# EAGLE schematic Board no 0R (EAGLE 9.6.2)
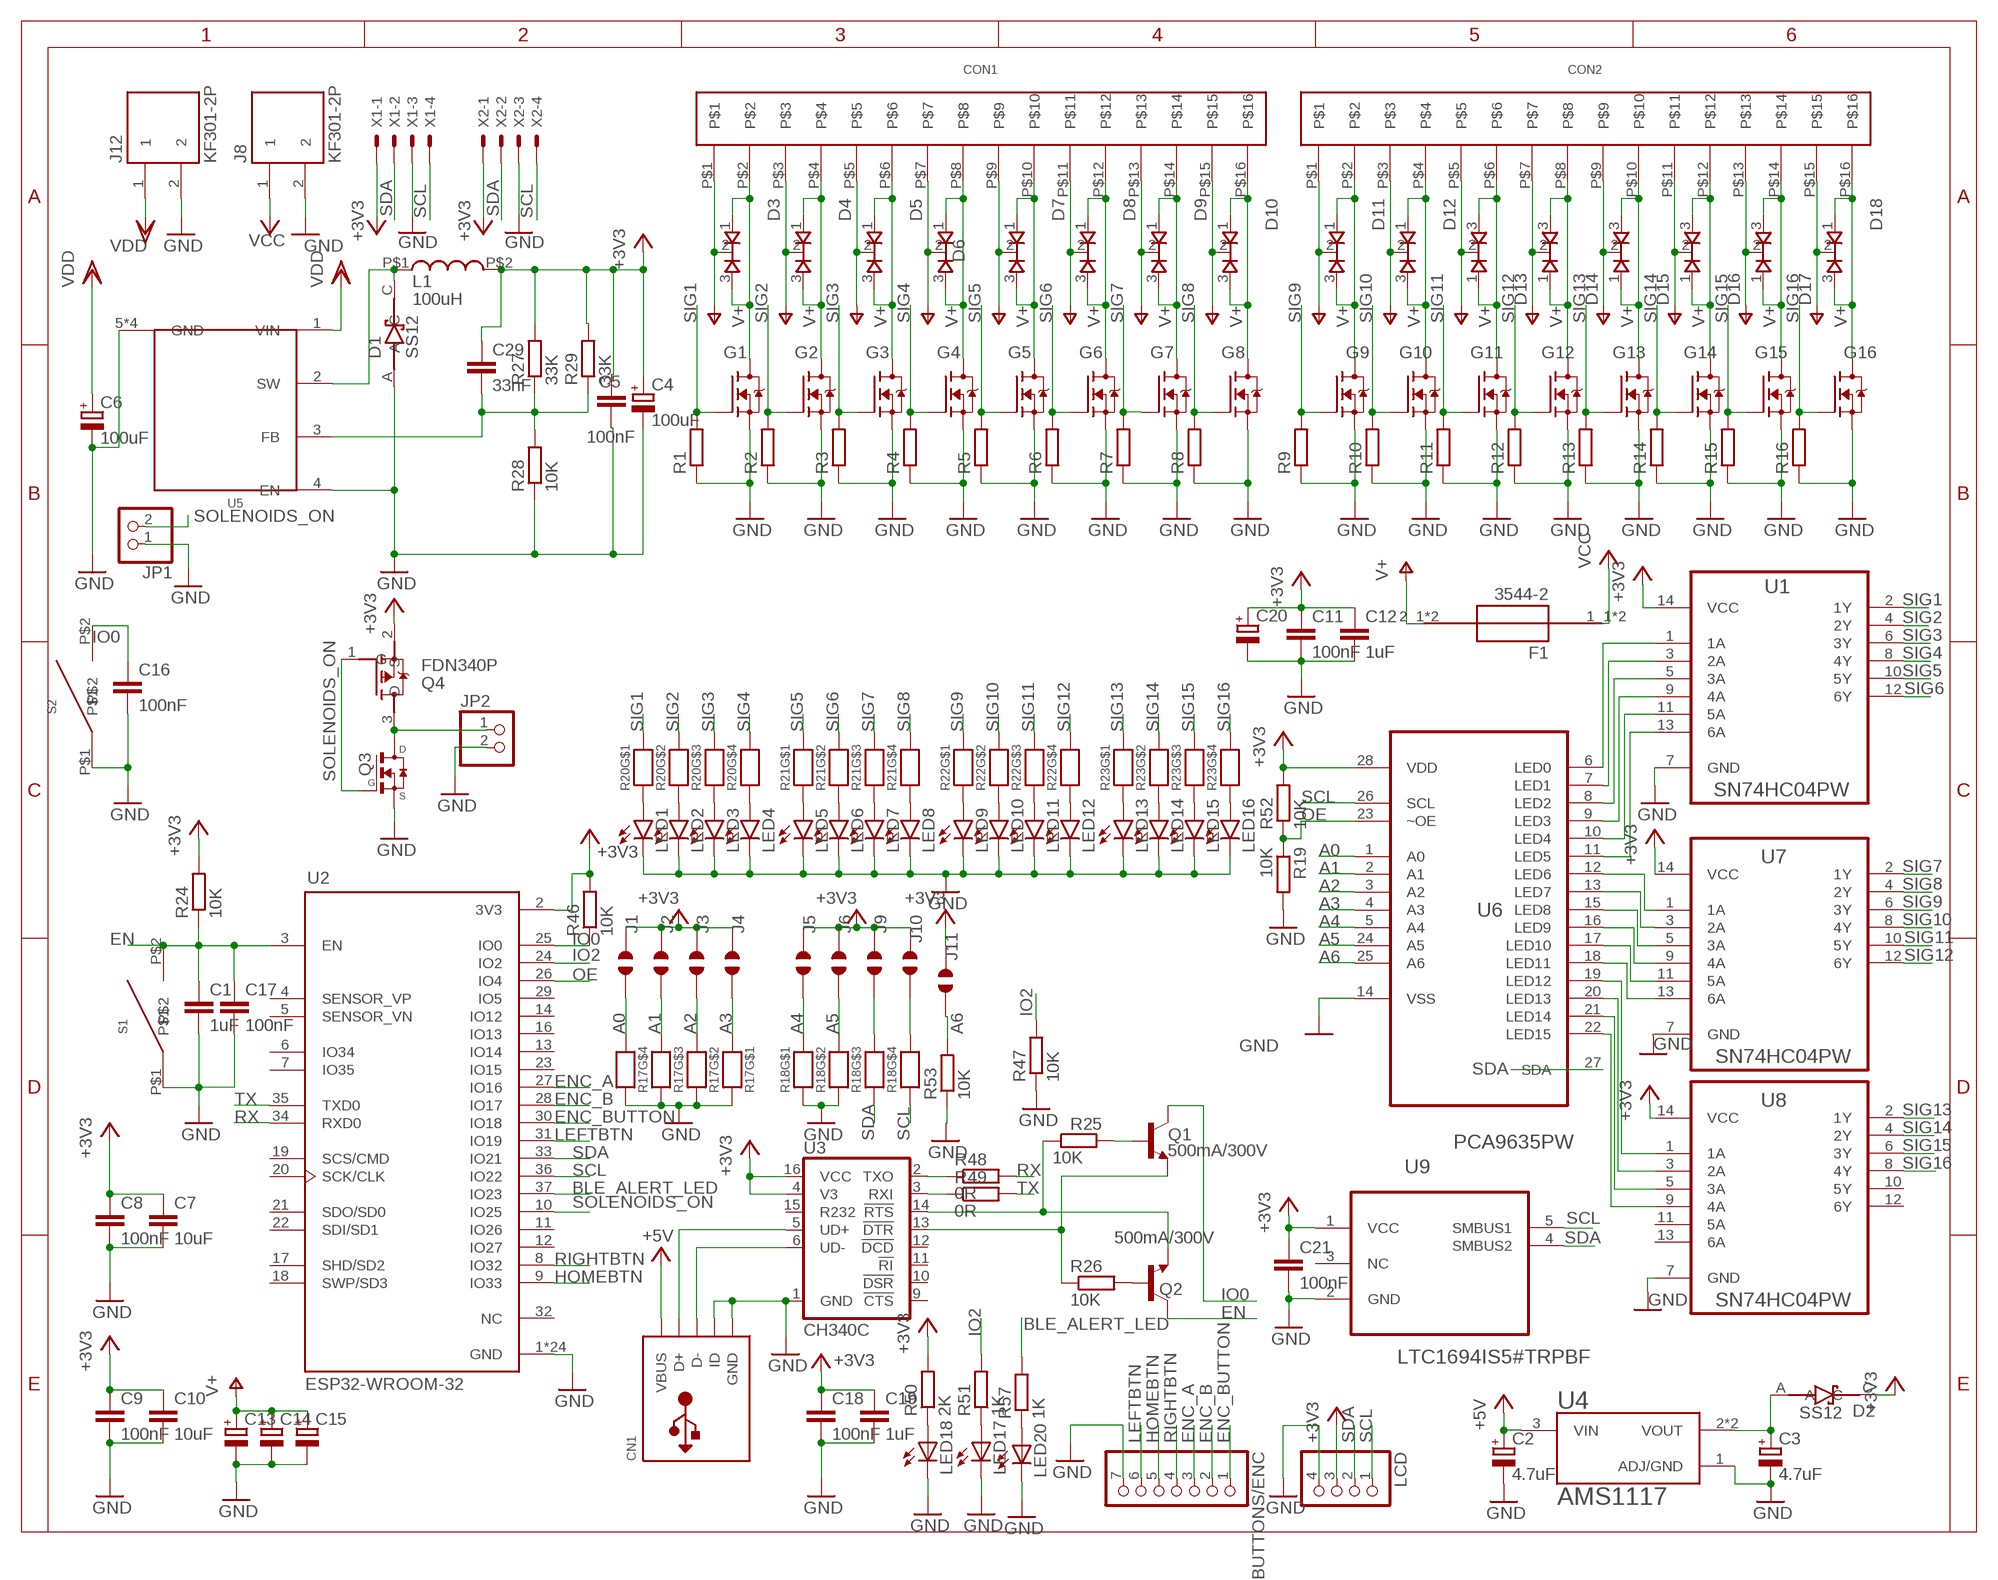
[diagram p0: schematic, sheet 1]

## Parts
BUTTONS/ENC  PINHD-1X7  [1X07]
C1  1uF  C-EUC0603  [C0603]
C2  4.7uF  CPOL-EUC/6032-28R  [C/6032-28R]
C3  4.7uF  CPOL-EUC/6032-28R  [C/6032-28R]
C4  100uF  CPOL-EUC/6032-28R  [C/6032-28R]
C5  100nF  C-EUC0603  [C0603]
C6  100uF  CPOL-EUC/6032-28R  [C/6032-28R]
C7  10uF  C-EUC0603  [C0603]
C8  100nF  C-EUC0603  [C0603]
C9  100nF  C-EUC0603  [C0603]
C10  10uF  C-EUC0603  [C0603]
C11  100nF  C-EUC0603  [C0603]
C12  1uF  C-EUC0603  [C0603]
C13  CPOL-EUE5-10.5  [E5-10,5]
C14  CPOL-EUE5-10.5  [E5-10,5]
C15  CPOL-EUE5-10.5  [E5-10,5]
C16  100nF  C-EUC0603  [C0603]
C17  100nF  C-EUC0603  [C0603]
C18  100nF  C-EUC0603  [C0603]
C19  1uF  C-EUC0603  [C0603]
C20  CPOL-EUB  [PANASONIC_B]
C21  100nF  C-EUC0603  [C0603]
C29  33nF  C-EUC0603  [C0603]
CN1  USBMINIB  [USB-MINIB]
CON1  2.54-16P  [2.54-16P]
CON2  2.54-16P  [2.54-16P]
D1  SS12  [DIOM4427X270N]
D2  SS12  [DIOM4427X270N]
D3  BYQ28E  [TO220V]
D4  BYQ28E  [TO220V]
D5  BYQ28E  [TO220V]
D6  BYQ28E  [TO220V]
D7  BYQ28E  [TO220V]
D8  BYQ28E  [TO220V]
D9  BYQ28E  [TO220V]
D10  BYQ28E  [TO220V]
D11  BYQ28E  [TO220V]
D12  BYQ28E  [TO220V]
D13  BYQ28E  [TO220V]
D14  BYQ28E  [TO220V]
D15  BYQ28E  [TO220V]
D16  BYQ28E  [TO220V]
D17  BYQ28E  [TO220V]
D18  BYQ28E  [TO220V]
F1  3544-2  [FUSE_3544-2]
G1  IRL540N  [TO220V]
G2  IRL540N  [TO220V]
G3  IRL540N  [TO220V]
G4  IRL540N  [TO220V]
G5  IRL540N  [TO220V]
G6  IRL540N  [TO220V]
G7  IRL540N  [TO220V]
G8  IRL540N  [TO220V]
G9  IRL540N  [TO220V]
G10  IRL540N  [TO220V]
G11  IRL540N  [TO220V]
G12  IRL540N  [TO220V]
G13  IRL540N  [TO220V]
G14  IRL540N  [TO220V]
G15  IRL540N  [TO220V]
G16  IRL540N  [TO220V]
J1  JUMPER_SOLDER_1X2  [JUMPER_SOLDER_1X2]
J2  JUMPER_SOLDER_1X2  [JUMPER_SOLDER_1X2]
J3  JUMPER_SOLDER_1X2  [JUMPER_SOLDER_1X2]
J4  JUMPER_SOLDER_1X2  [JUMPER_SOLDER_1X2]
J5  JUMPER_SOLDER_1X2  [JUMPER_SOLDER_1X2]
J6  JUMPER_SOLDER_1X2  [JUMPER_SOLDER_1X2]
J8  KF301-2P  [KF301-2P]
J9  JUMPER_SOLDER_1X2  [JUMPER_SOLDER_1X2]
J10  JUMPER_SOLDER_1X2  [JUMPER_SOLDER_1X2]
J11  JUMPER_SOLDER_1X2  [JUMPER_SOLDER_1X2]
J12  KF301-2P  [KF301-2P]
JP1  PINHD-1X2  [1X02]
JP2  PINHD-1X2  [1X02]
L1  100uH  CD43  [CD43]
LCD  PINHD-1X4  [1X04]
LED1  LEDSMT1206  [1206]
LED2  LEDSMT1206  [1206]
LED3  LEDSMT1206  [1206]
LED4  LEDSMT1206  [1206]
LED5  LEDSMT1206  [1206]
LED6  LEDSMT1206  [1206]
LED7  LEDSMT1206  [1206]
LED8  LEDSMT1206  [1206]
LED9  LEDSMT1206  [1206]
LED10  LEDSMT1206  [1206]
LED11  LEDSMT1206  [1206]
LED12  LEDSMT1206  [1206]
LED13  LEDSMT1206  [1206]
LED14  LEDSMT1206  [1206]
LED15  LEDSMT1206  [1206]
LED16  LEDSMT1206  [1206]
LED17  LED-0603  [LED-603]
LED18  LED-0603  [LED-603]
LED20  LED-0603  [LED-603]
Q1  500mA/300V  TRANS_NPN-MMBTA42  [SOT23-3]
Q2  500mA/300V  TRANS_NPN-MMBTA42  [SOT23-3]
Q3  FDN337N  [SSOT-3]
Q4  FDN340P  [SOT95P240X120-3N]
R1  R-EU_R0603  [R0603]
R2  R-EU_R0603  [R0603]
R3  R-EU_R0603  [R0603]
R4  R-EU_R0603  [R0603]
R5  R-EU_R0603  [R0603]
R6  R-EU_R0603  [R0603]
R7  R-EU_R0603  [R0603]
R8  R-EU_R0603  [R0603]
R9  R-EU_R0603  [R0603]
R10  R-EU_R0603  [R0603]
R11  R-EU_R0603  [R0603]
R12  R-EU_R0603  [R0603]
R13  R-EU_R0603  [R0603]
R14  R-EU_R0603  [R0603]
R15  R-EU_R0603  [R0603]
R16  R-EU_R0603  [R0603]
R17  MICROBUILDER_RESISTOR_4PACK  [MICROBUILDER_RESPACK_4X0603]
R18  MICROBUILDER_RESISTOR_4PACK  [MICROBUILDER_RESPACK_4X0603]
R19  10K  R-EU_R1206  [R1206]
R20  MICROBUILDER_RESISTOR_4PACK  [MICROBUILDER_RESPACK_4X0603]
R21  MICROBUILDER_RESISTOR_4PACK  [MICROBUILDER_RESPACK_4X0603]
R22  MICROBUILDER_RESISTOR_4PACK  [MICROBUILDER_RESPACK_4X0603]
R23  MICROBUILDER_RESISTOR_4PACK  [MICROBUILDER_RESPACK_4X0603]
R24  10K  R-EU_R0603  [R0603]
R25  10K  R-EU_R0603  [R0603]
R26  10K  R-EU_R0603  [R0603]
R27  33K  R-EU_R0603  [R0603]
R28  10K  R-EU_R0603  [R0603]
R29  33K  R-EU_R0603  [R0603]
R46  10K  R-EU_R0603  [R0603]
R47  10K  R-EU_R0603  [R0603]
R48  0R  R-EU_R0603  [R0603]
R49  0R  R-EU_R0603  [R0603]
R50  2K  R-EU_R0603  [R0603]
R51  1K  R-EU_R0603  [R0603]
R52  10K  R-EU_R0603  [R0603]
R53  10K  R-EU_R0603  [R0603]
R57  1K  R-EU_R0603  [R0603]
S1  3X6X2.5  [3X6X2.5]
S2  3X6X2.5  [3X6X2.5]
U1  SN74HC04PW  [SOP65P640X120-14N]
U2  ESP32-WROOM-32  [MODULE_ESP32-WROOM-32]
U3  CH340C  [SO016]
U4  AMS1117  [SOT229P700X180-4N]
U5  XL7005A  [SO8]
U6  PCA9635PW  [SOP65P640X110-28N]
U7  SN74HC04PW  [SOP65P640X120-14N]
U8  SN74HC04PW  [SOP65P640X120-14N]
U9  LTC1694IS5#TRPBF  [SOT95P280X100-5N]
X1  JST-XH-04-PIN-LONG-PAD  [JST-XH-04-PACKAGE-LONG-PAD]
X2  JST-XH-04-PIN-LONG-PAD  [JST-XH-04-PACKAGE-LONG-PAD]

## Nets
+3V3: C4.+ C5.1 C7.1 C8.1 C9.1 C10.1 C11.1 C12.1 C18.1 C19.1 C20.+ C21.1 C29.1 D2.C J1.1 J2.1 J3.1 J4.1 J5.1 J6.1 J9.1 J10.1 J11.1 L1.P$2 LCD.3 Q4.2(S) R24.2 R27.2 R29.2 R46.2 R50.2 R52.2 U1.14(VCC) U2.2(3V3) U3.4(V3) U3.16(VCC) U6.28(VDD) U7.14(VCC) U8.14(VCC) U9.1(VCC) X1.1 X2.1
+5V: C2.+ CN1.VBUS U4.3(VIN)
A0: J1.2 R17.4 U6.1(A0)
A1: J2.2 R17.3 U6.2(A1)
A2: J3.2 R17.2 U6.3(A2)
A3: J4.2 R17.1 U6.4(A3)
A4: J5.2 R18.8 U6.5(A4)
A5: J6.2 R18.7 U6.24(A5)
A6: J11.2 R53.2 U6.25(A6)
BLE_ALERT_LED: R57.2 U2.37(IO23)
EN: C1.1 C17.1 Q2.3(C) R24.1 S1.P$2 U2.3(EN)
ENC_A: BUTTONS/ENC.3 U2.27(IO16)
ENC_B: BUTTONS/ENC.2 U2.28(IO17)
ENC_BUTTON: BUTTONS/ENC.1 U2.30(IO18)
GND: BUTTONS/ENC.7 C1.2 C2.- C3.- C4.- C5.2 C6.- C7.2 C8.2 C9.2 C10.2 C11.2 C12.2 C13.- C14.- C15.- C16.2 C17.2 C18.2 C19.2 C20.- C21.2 CN1.GND CN1.ID D1.A G1.3(S) G2.3(S) G3.3(S) G4.3(S) G5.3(S) G6.3(S) G7.3(S) G8.3(S) G9.3(S) G10.3(S) G11.3(S) G12.3(S) G13.3(S) G14.3(S) G15.3(S) G16.3(S) J8.2 J12.2 JP1.1 JP2.2 LCD.4 LED1.C LED2.C LED3.C LED4.C LED5.C LED6.C LED7.C LED8.C LED9.C LED10.C LED11.C LED12.C LED13.C LED14.C LED15.C LED16.C LED17.C LED18.C LED20.C Q3.2(S) R1.1 R2.1 R3.1 R4.1 R5.1 R6.1 R7.1 R8.1 R9.1 R10.1 R11.1 R12.1 R13.1 R14.1 R15.1 R16.1 R17.5 R17.6 R17.7 R17.8 R18.1 R18.2 R19.2 R28.1 R47.1 R53.1 S1.P$1 S2.P$1 U1.7(GND) U2.1(GND) U2.15(GND) U2.38(GND) U2.39_1(GND) U2.39_2(GND) U2.39_3(GND) U2.39_4(GND) U2.39_5(GND) U2.39_6(GND) U2.39_7(GND) U2.39_8(GND) U2.39_9(GND) U2.39_10(GND) U2.39_11(GND) U2.39_12(GND) U2.39_13(GND) U2.39_14(GND) U2.39_15(GND) U2.39_16(GND) U2.39_17(GND) U2.39_18(GND) U2.39_19(GND) U2.39_20(GND) U2.39_21(GND) U3.1(GND) U4.1(ADJ/GND) U5.4(EN) U5.5(GND) U5.6(GND) U5.7(GND) U5.8(GND) U6.14(VSS) U7.7(GND) U8.7(GND) U9.2(GND) X1.3 X2.3
HOMEBTN: BUTTONS/ENC.5 U2.9(IO33)
IO0: C16.1 Q1.3(C) R46.1 S2.P$2 U2.25(IO0)
IO2: R47.2 R51.2 U2.24(IO2)
LEFTBTN: BUTTONS/ENC.6 U2.31(IO19)
N$1 [power]: CON1.P$2 D3.1 D3.3 G1.2(D)
N$2 [power]: CON1.P$4 D4.1 D4.3 G2.2(D)
N$3 [power]: CON1.P$6 D5.1 D5.3 G3.2(D)
N$4 [power]: CON1.P$8 D6.1 D6.3 G4.2(D)
N$5 [power]: CON1.P$10 D7.1 D7.3 G5.2(D)
N$6 [power]: CON1.P$12 D8.1 D8.3 G6.2(D)
N$7 [power]: CON1.P$14 D9.1 D9.3 G7.2(D)
N$8 [power]: CON1.P$16 D10.1 D10.3 G8.2(D)
N$9 [power]: CON2.P$2 D11.1 D11.3 G9.2(D)
N$10 [power]: CON2.P$4 D12.1 D12.3 G10.2(D)
N$11 [power]: CON2.P$6 D13.1 D13.3 G11.2(D)
N$12 [power]: CON2.P$8 D14.1 D14.3 G12.2(D)
N$13 [power]: CON2.P$10 D15.1 D15.3 G13.2(D)
N$14 [power]: CON2.P$12 D16.1 D16.3 G14.2(D)
N$15 [power]: CON2.P$14 D17.1 D17.3 G15.2(D)
N$16 [power]: CON2.P$16 D18.1 D18.3 G16.2(D)
N$17: Q1.1(B) R25.2
N$18: Q2.1(B) R26.2
N$19: LED1.A R20.1
N$20: LED2.A R20.2
N$21: LED3.A R20.3
N$22: LED4.A R20.4
N$23: LED5.A R21.1
N$24: LED6.A R21.2
N$25: LED7.A R21.3
N$27: LED8.A R21.4
N$28: LED9.A R22.1
N$29: LED10.A R22.2
N$30: LED11.A R22.3
N$31: LED12.A R22.4
N$32: LED13.A R23.1
N$33: LED14.A R23.2
N$34: LED15.A R23.3
N$35: Q2.2(E) R25.1 U3.14(!RTS)
N$36: Q1.2(E) R26.1 U3.13(!DTR)
N$37: JP2.1 Q3.3(D) Q4.3(D)
N$38: J9.2 R18.6
N$39: CN1.D- U3.6(UD-)
N$40: CN1.D+ U3.5(UD+)
N$41: J10.2 R18.5
N$42: C3.+ D2.A U4.2(VOUT) U4.4(VOUT)
N$43: LED16.A R23.4
N$44: C29.2 R27.1 R28.2 R29.1 U5.3(FB)
N$46: R48.1 U3.2(TXO)
N$48: R49.1 U3.3(RXI)
N$50: LED20.A R57.1
N$54: LED18.A R50.1
N$64: LED17.A R51.1
N$65: D1.C L1.P$1 U5.2(SW)
N$66: U1.1(1A) U6.6(LED0)
N$67: U1.3(2A) U6.7(LED1)
N$68: U1.5(3A) U6.8(LED2)
N$69: U1.9(4A) U6.9(LED3)
N$70: U1.11(5A) U6.10(LED4)
N$71: U1.13(6A) U6.11(LED5)
N$72: U6.12(LED6) U7.1(1A)
N$73: U6.13(LED7) U7.3(2A)
N$74: U6.15(LED8) U7.5(3A)
N$75: U6.16(LED9) U7.9(4A)
N$76: U6.17(LED10) U7.11(5A)
N$77: U6.18(LED11) U7.13(6A)
N$78: U6.19(LED12) U8.1(1A)
N$79: U6.20(LED13) U8.3(2A)
N$80: U6.21(LED14) U8.5(3A)
N$81: U6.22(LED15) U8.9(4A)
OE: R19.1 R52.1 U2.26(IO4) U6.23(~OE)
RIGHTBTN: BUTTONS/ENC.4 U2.8(IO32)
RX: R48.2 U2.34(RXD0)
SCL: LCD.1 R18.4 U2.36(IO22) U6.26(SCL) U9.5(SMBUS1) X1.4 X2.4
SDA: LCD.2 R18.3 U2.33(IO21) U6.27(SDA) U9.4(SMBUS2) X1.2 X2.2
SIG1: G1.1(G) R1.2 R20.8 U1.2(1Y)
SIG2: G2.1(G) R2.2 R20.7 U1.4(2Y)
SIG3: G3.1(G) R3.2 R20.6 U1.6(3Y)
SIG4: G4.1(G) R4.2 R20.5 U1.8(4Y)
SIG5: G5.1(G) R5.2 R21.8 U1.10(5Y)
SIG6: G6.1(G) R6.2 R21.7 U1.12(6Y)
SIG7: G7.1(G) R7.2 R21.6 U7.2(1Y)
SIG8: G8.1(G) R8.2 R21.5 U7.4(2Y)
SIG9: G9.1(G) R9.2 R22.8 U7.6(3Y)
SIG10: G10.1(G) R10.2 R22.7 U7.8(4Y)
SIG11: G11.1(G) R11.2 R22.6 U7.10(5Y)
SIG12: G12.1(G) R12.2 R22.5 U7.12(6Y)
SIG13: G13.1(G) R13.2 R23.8 U8.2(1Y)
SIG14: G14.1(G) R14.2 R23.7 U8.4(2Y)
SIG15: G15.1(G) R15.2 R23.6 U8.6(3Y)
SIG16: G16.1(G) R16.2 R23.5 U8.8(4Y)
SOLENOIDS_ON: JP1.2 Q3.1(G) Q4.1(G) U2.10(IO25)
TX: R49.2 U2.35(TXD0)
V+: C13.+ C14.+ C15.+ CON1.P$1 CON1.P$3 CON1.P$5 CON1.P$7 CON1.P$9 CON1.P$11 CON1.P$13 CON1.P$15 CON2.P$1 CON2.P$3 CON2.P$5 CON2.P$7 CON2.P$9 CON2.P$11 CON2.P$13 CON2.P$15 D3.2 D4.2 D5.2 D6.2 D7.2 D8.2 D9.2 D10.2 D11.2 D12.2 D13.2 D14.2 D15.2 D16.2 D17.2 D18.2 F1.2_1 F1.2_2
VCC [power]: F1.1_1 F1.1_2 J8.1
VDD [power]: C6.+ J12.1 U5.1(VIN)
Unconnected: U2.4(SENSOR_VP) U2.5(SENSOR_VN) U2.6(IO34) U2.7(IO35) U2.11(IO26) U2.12(IO27) U2.13(IO14) U2.14(IO12) U2.16(IO13) U2.17(SHD/SD2) U2.18(SWP/SD3) U2.19(SCS/CMD) U2.20(SCK/CLK) U2.21(SDO/SD0) U2.22(SDI/SD1) U2.23(IO15) U2.29(IO5) U2.32(NC) U3.9(!CTS) U3.10(!DSR) U3.11(!RI) U3.12(!DCD) U3.15(R232) U8.10(5Y) U8.11(5A) U8.12(6Y) U8.13(6A) U9.3(NC)

## Library data of the parts
BUTTONS/ENC = pinhead:PINHD-1X7: PIN HEADER
C1 C5 C7-C12 C16-C19 C21 C29 = rcl:C-EU: CAPACITOR, European symbol; SPICEPREFIX: C
C2-C4 C6 C13-C15 C20 = rcl:CPOL-EU: POLARIZED CAPACITOR, European symbol; SPICEPREFIX: C
CN1 = adafruit:USB: USB Connectors USBMINIB - Surface Mount Female Mini-B USB Connector 4UConnector: 06564 By microbuilder.eu Thru-hole RA Female Mini-B USB Connector 4UConnector: 18732 By ladyada.net
CON1 CON2 = Screw Terminals:2.54-16P
D1 D2 = SS12:SS12: SS12 Series 500 mV 1 A 20 V Max Reverse Voltage Schottky Rectifier - DO-214AC Check prices <https://pricing.snapeda.com/parts/SS12/ON%20Semiconductor/view-part?ref=eda>; AVAILABILITY: In Stock; DESCRIPTION: 3/8 Hex Socket Nut Driver 3.75 (95.3mm); MF: ON Semiconductor; MP: SS12; PACKAGE: SMA-2 ON Semiconductor; PRICE: None; PURCHASE-URL: https://pricing.snapeda.com/search/part/SS12/?ref=eda
D3-D18 = BYQ28E:BYQ28E
F1 = 3544-2 Mini Auto Blade Fuse Holder:3544-2: Fuse Clip; 500 VAC; 30 A; PCB; For 0.110 in. x 0.032 in. mini blade fuses Check availability <https://pricing.snapeda.com/parts/3544-2/Keystone%20Electronics/view-part?ref=eda>; AVAILABILITY: In Stock; DESCRIPTION: THM-Vertical Entry Mini Auto Fuse Holder; MF: Keystone Electronics; MP: 3544-2; PACKAGE: None; PRICE: None; PURCHASE-URL: https://pricing.snapeda.com/search/part/3544-2/?ref=eda
G1-G16 = IRL540N:IRL540N
J1-J6 J9-J11 = dp_devices:JUMPER_SOLDER_1X2
J8 J12 = Screw Terminals:KF301-2P: 2 Pin Terminal Block 5mm Pitch Check availability <https://pricing.snapeda.com/parts/KF301-2P/Handson%20Technology/view-part?ref=eda>; AVAILABILITY: Not in stock; DESCRIPTION: 2 Pin Terminal Block 5mm Pitch; MF: Handson Technology; MP: KF301-2P; PACKAGE: None; PRICE: None
JP1 JP2 = pinhead:PINHD-1X2: PIN HEADER
L1 = CDXX Unshielded Inductors:CD43
LCD = pinhead:PINHD-1X4: PIN HEADER
LED1-LED16 = led:LED: LED OSRAM: - CHIPLED LG R971, LG N971, LY N971, LG Q971, LY Q971, LO R971, LY R971 LH N974, LH R974 LS Q976, LO Q976, LY Q976 LO Q996 - Hyper CHIPLED LW Q18S LB Q993, LB Q99A, LB R99A - SideLED LS A670, LO A670, LY A670, LG A670, LP A670 LB A673, LV A673, LT A673, LW A673 LH A674 LY A675 LS A676, LA A676, LO A676, LY A676, LW A676 LS A679, LY A679, LG A679 - Hyper Micro SIDELED® LS Y876, LA Y876, LO Y876, LY Y876 LT Y87S - SmartLED LW L88C, LW L88S LB L89C, LB L89S, LG L890 LS L89K, LO L89K, LY L89K LS L896, LA L896, LO L896, LY L896 - TOPLED LS T670, LO T670, LY T670, LG T670, LP T670 LSG T670, LSP T670, LSY T670, LOP T670, LYG T670 LG T671, LOG T671, LSG T671 LB T673, LV T673, LT T673, LW T673 LH T674 LS T676, LA T676, LO T676, LY T676, LB T676, LH T676, LSB T676, LW T676 LB T67C, LV T67C, LT T67C, LS T67K, LO T67K, LY T67K, LW E67C LS E67B, LA E67B, LO E67B, LY E67B, LB E67C, LV E67C, LT E67C LW T67C LS T679, LY T679, LG T679 LS T770, LO T770, LY T770, LG T770, LP T770 LB T773, LV T773, LT T773, LW T773 LH T774 LS E675, LA E675, LY E675, LS T675 LS T776, LA T776, LO T776, LY T776, LB T776 LHGB T686 LT T68C, LB T68C - Hyper Mini TOPLED® LB M676 - Mini TOPLED Santana® LG M470 LS M47K, LO M47K, LY M47K Source: http://www.osram.convergy.de LUXEON: - LUMILED® LXK2-PW12-R00, LXK2-PW12-S00, LXK2-PW14-U00, LXK2-PW14-V00 LXK2-PM12-R00, LXK2-PM12-S00, LXK2-PM14-U00 LXK2-PE12-Q00, LXK2-PE12-R00, LXK2-PE12-S00, LXK2-PE14-T00, LXK2-PE14-U00 LXK2-PB12-K00, LXK2-PB12-L00, LXK2-PB12-M00, LXK2-PB14-N00, LXK2-PB14-P00, LXK2-PB14-Q00 LXK2-PR12-L00, LXK2-PR12-M00, LXK2-PR14-Q00, LXK2-PR14-R00 LXK2-PD12-Q00, LXK2-PD12-R00, LXK2-PD12-S00 LXK2-PH12-R00, LXK2-PH12-S00 LXK2-PL12-P00, LXK2-PL12-Q00, LXK2-PL12-R00 Source: www.luxeon.com KINGBRIGHT: KA-3528ASYC Source: www.kingbright.com
LED17 LED18 LED20 = dp_devices:LED: Light Emitting Diode
Q1 Q2 = SparkFun-DiscreteSemi:TRANS_NPN: NPN transistor Current controlled devices typically used to amplify current or used as a switch. BC547 - COM-08928 <http://www.sparkfun.com/products/8928> (TO-92 45V 100mA) (1.Collector 2.Base 3.Emitter) 2N3904 - COM-00521 <http://www.sparkfun.com/products/521> (TO-92 40V 200mA) (1.Emitter 2.Base 3.Collector) P2N2222A - COM-12852 <http://www.sparkfun.com/products/12852> (TO-92 40V 600mA) (1.Collector 2.Base 3.Emitter); PROD_ID: TRANS-09116
Q3 = FDN337N:FDN337N: N-Channel MOSFET Logic Level Enhancement Mode Field Effect Transistor Check prices <https://pricing.snapeda.com/parts/FDN337N/ON%20Semiconductor/view-part?ref=eda>; AVAILABILITY: In Stock; DESCRIPTION: FDN337 Series 30 V 65 mOhm N-Ch Field Effect Transistor - SSOT-3; MF: ON Semiconductor; MP: FDN337N; PACKAGE: TO-236-3 ON; PRICE: None; PURCHASE-URL: https://pricing.snapeda.com/search/part/FDN337N/?ref=eda
Q4 = FDN340P:FDN340P: FDN340P Series 20V 70 mOhm Single P-Ch Logic Level PowerTrench Mosfet SSOT-3 Check prices <https://pricing.snapeda.com/parts/FDN340P/ON%20Semiconductor/view-part?ref=eda>; AVAILABILITY: In Stock; DESCRIPTION: P-Channel 20V 2A (Ta) 500mW (Ta) Surface Mount SuperSOT-3; MF: ON Semiconductor; MP: FDN340P; PACKAGE: TO-236-3 ON; PRICE: None; PURCHASE-URL: https://pricing.snapeda.com/search/part/FDN340P/?ref=eda
R1-R16 R19 R24-R29 R46-R53 R57 = rcl:R-EU_: RESISTOR, European symbol; SPICEPREFIX: R
R17 R18 R20-R23 = Adafruit PCA9685 rev C:MICROBUILDER_RESISTOR_4PACK: Resistor Packs (4 resistors) 4 x 0603 10K 1/16W - Digikey: YC164J-10KCT-ND
S1 S2 = Microbuttons:3X6X2.5
U1 U7 U8 = Texas Instruments_By_element14_Batch_1:SN74HC04PW: HEX INVERTERS; MPN: SN74HC04PW; OC_FARNELL: 9590960; OC_NEWARK: 98K0347; PACKAGE: SOP-14; SUPPLIER: Texas Instruments
U2 = ESP32-WROOM-32:ESP32-WROOM-32: Check availability <https://pricing.snapeda.com/parts/ESP32-WROOM-32/Espressif%20Systems/view-part?ref=eda>; AVAILABILITY: In Stock; DESCRIPTION: Bluetooth, WiFi 802.11b/g/n, Bluetooth v4.2 +EDR, Class 1, 2 and 3 Transceiver Module 2.4GHz ~ 2.5GHz Antenna Not Included, U.FL Surface Mount; MF: Espressif Systems; MP: ESP32-WROOM-32; PACKAGE: Module Espressif Systems; PRICE: None; PURCHASE-URL: https://pricing.snapeda.com/search/part/ESP32-WROOM-32/?ref=eda
U3 = CH340C:CH340C; AVAILABILITY: Unavailable; DESCRIPTION: USB to serial chip CH340; MF: WCH; MP: CH340C; PACKAGE: Package; PRICE: None
U4 = AMS1117:AMS1117: Sot223/Pkg 1-Amp 5-Volt Low Drop Out Voltage Regulatator Check prices <https://pricing.snapeda.com/parts/AMS1117/Advanced%20Monolithic%20Systems/view-part?ref=eda>; AVAILABILITY: In Stock; DESCRIPTION: 1A LOW DROPOUT VOLTAGE REGULATOR SOT-223; MF: Advanced Monolithic Systems; MP: AMS1117; PACKAGE: SOT-223 Seeed Technology; PRICE: None
U5 = XL7005A:XL7005A
U6 = PCA9635PW:PCA9635PW: 16-bit Fm+ I2C-bus LED driver Check availability <https://pricing.snapeda.com/parts/PCA9635PW/NXP%20Semiconductors/view-part?ref=eda>; AVAILABILITY: In Stock; DESCRIPTION: LED Driver IC 16 Output Linear - PWM Dimming 25mA 28-TSSOP; MF: NXP Semiconductors; MP: PCA9635PW; PACKAGE: TSSOP-28 NXP USA; PRICE: None; PURCHASE-URL: https://pricing.snapeda.com/search/part/PCA9635PW/?ref=eda
U9 = LTC1694IS5_TRPBF:LTC1694IS5#TRPBF: SMBus/I2C Accelerator Check availability <https://pricing.snapeda.com/parts/LTC1694IS5%23TRPBF/Analog%20Devices/view-part?ref=eda>; AVAILABILITY: In Stock; CHECK_PRICES: https://www.snapeda.com/parts/LTC1694IS5%23TRPBF/Analog+Devices/view-part/?ref=eda; DESCRIPTION: SMBus/I²C Accelerator; MF: Analog Devices; MP: LTC1694IS5#TRPBF; PACKAGE: SOT-5 Analog Devices; PRICE: None; PURCHASE-URL: https://www.snapeda.com/api/url_track_click_mouser/?unipart_id=5165549&manufacturer=Analog Devices&part_name=LTC1694IS5#TRPBF&search_term=ltc1694; SNAPEDA_LINK: https://www.snapeda.com/parts/LTC1694IS5%23TRPBF/Analog+Devices/view-part/?ref=snap
X1 X2 = Rembrandt Electronics - JST XH Connectors v1-0:JST-XH-04-PIN: JST XH Connector 2 Pin Wire to board connector. Pitch: 2,54 mm, (0.100") Number of pins: 4 Created by Rembrandt Electronics www.rembrandtelectronics.com

## Net classes
1 power: clearance 0.254 mm